# Altium schematic sheet nixie_peripherals.SchDoc: Nixie Peripherals
size A4; Author: Manuel Diaz Alonso; Address1: 2; Address2: 2; Revision: 1; SheetNumber: 2; SheetTotal: 2
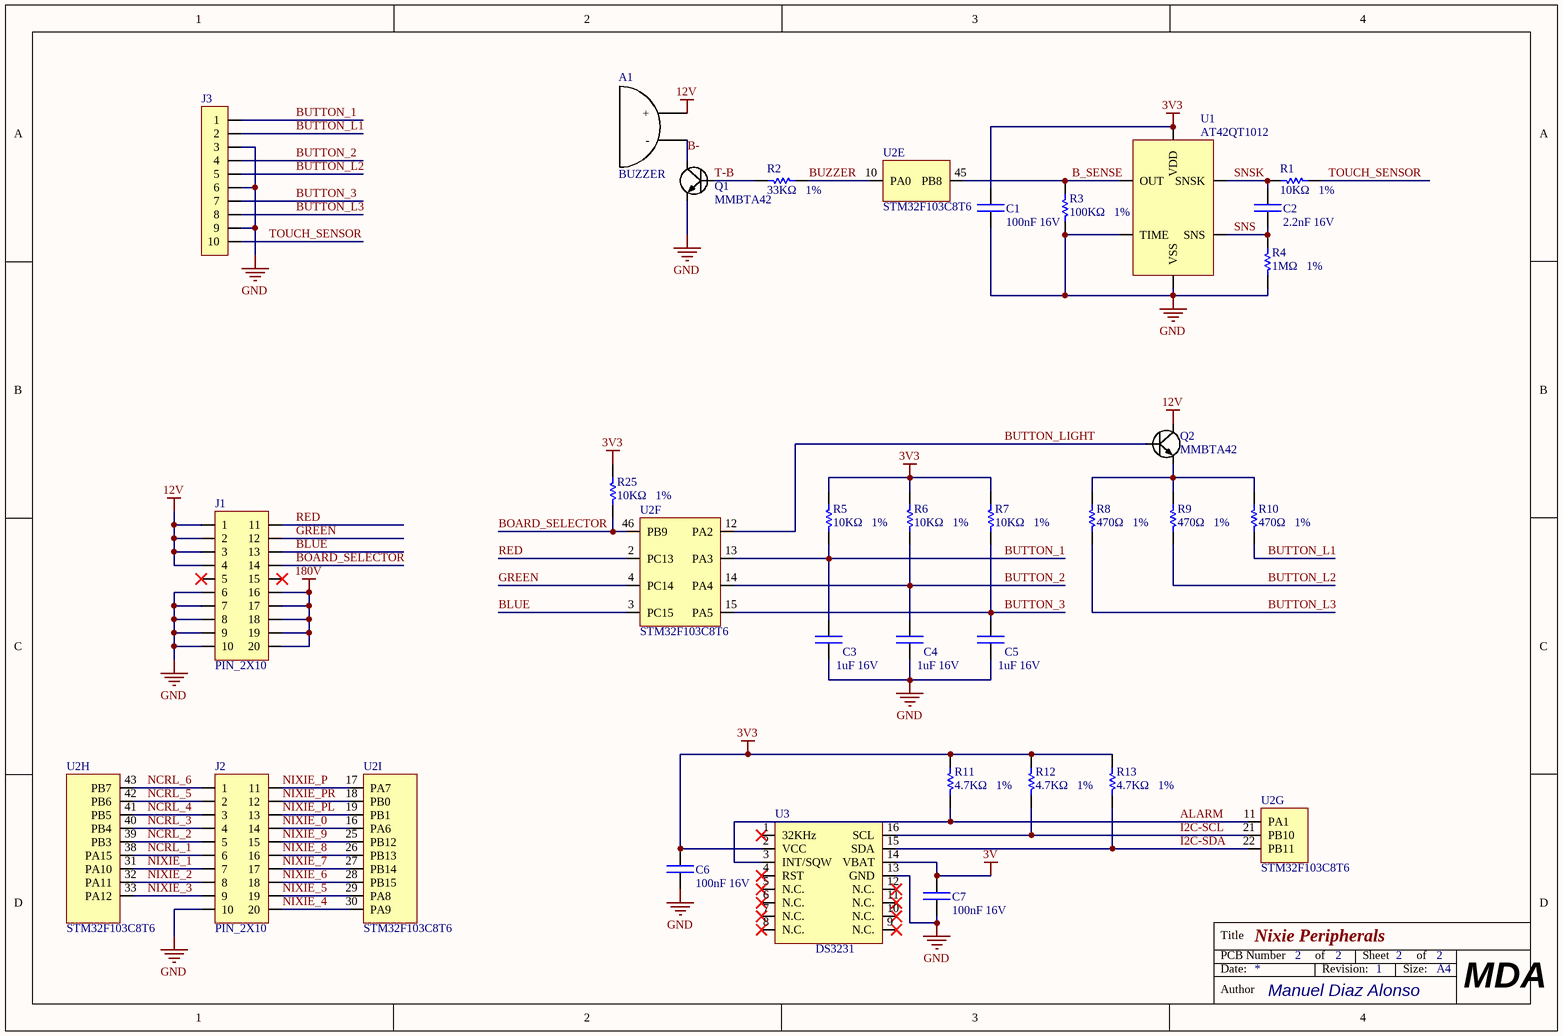
[diagram p0: nixie_peripherals.SchDoc]

## Parts
A1  BUZZER  [BUZZER]
C1  100nF 16V  [0603]
C2  2.2nF 16V  [0603]
C3  1uF 16V  [0603]
C4  1uF 16V  [0603]
C5  1uF 16V  [0603]
C6  100nF 16V  [0603]
C7  100nF 16V  [0603]
J1  PIN_2X10  [PIN_2X10_SKT]
J2  PIN_2X10  [PIN_2X10_SKT]
J3  HEADERx10  [HEADERx10]  (value not drawn)
Q1  MMBTA42  [SOT-23]
Q2  MMBTA42  [SOT-23]
R1  10KΩ   1%  [0603]
R2  33KΩ   1%  [0603]
R3  100KΩ   1%  [0603]
R4  1MΩ   1%  [0603]
R5  10KΩ   1%  [0603]
R6  10KΩ   1%  [0603]
R7  10KΩ   1%  [0603]
R8  470Ω   1%  [0603]
R9  470Ω   1%  [0603]
R10  470Ω   1%  [0603]
R11  4.7KΩ   1%  [0603]
R12  4.7KΩ   1%  [0603]
R13  4.7KΩ   1%  [0603]
R25  10KΩ   1%  [0603]
U1  AT42QT1012  [SOT-23-6]
U2  STM32F103C8T6  [LQFP48]  (parts E,F,G,H,I of 9)
U3  DS3231  [SO16W]

## Nets
3V: C7.2 U3.14(VBAT)
3V3: C1.1 C6.2 R5.2 R6.2 R7.2 R11.2 R12.2 R13.2 R25.1 U1.5(VDD) U3.2(VCC)
12V: A1.1(+) J1.1 J1.2 J1.3 J1.4 Q2.3(C)
180V: J1.16 J1.17 J1.18 J1.19 J1.20
GND: C1.2 C3.1 C4.1 C5.1 C6.1 C7.1 J1.6 J1.7 J1.8 J1.9 J1.10 J2.10 J3.3 J3.6 J3.9 Q1.2(E) R3.1 R4.2 U1.2(VSS) U1.6(TIME) U3.13(GND)
ALARM: R11.1 U2.11(PA1) U3.3(INT/SQW)
B-: A1.2(-) Q1.3(C)
B_SENSE: R3.2 U1.1(OUT) U2.45(PB8)
BLUE: J1.13 U2.3(PC15)
BOARD_SELECTOR: J1.14 R25.2 U2.46(PB9)
BUTTON_1: C3.2 J3.1 R5.1 U2.13(PA3)
BUTTON_2: C4.2 J3.4 R6.1 U2.14(PA4)
BUTTON_3: C5.2 J3.7 R7.1 U2.15(PA5)
BUTTON_L1: J3.2 R10.2
BUTTON_L2: J3.5 R9.2
BUTTON_L3: J3.8 R8.2
BUTTON_LIGHT: Q2.1(B) U2.12(PA2)
BUZZER: R2.2 U2.10(PA0)
GREEN: J1.12 U2.4(PC14)
I2C-SCL: R12.1 U2.21(PB10) U3.16(SCL)
I2C-SDA: R13.1 U2.22(PB11) U3.15(SDA)
NCRL_1: J2.6 U2.38(PA15)
NCRL_2: J2.5 U2.39(PB3)
NCRL_3: J2.4 U2.40(PB4)
NCRL_4: J2.3 U2.41(PB5)
NCRL_5: J2.2 U2.42(PB6)
NCRL_6: J2.1 U2.43(PB7)
NIXIE_0: J2.14 U2.16(PA6)
NIXIE_1: J2.7 U2.31(PA10)
NIXIE_2: J2.8 U2.32(PA11)
NIXIE_3: J2.9 U2.33(PA12)
NIXIE_4: J2.20 U2.30(PA9)
NIXIE_5: J2.19 U2.29(PA8)
NIXIE_6: J2.18 U2.28(PB15)
NIXIE_7: J2.17 U2.27(PB14)
NIXIE_8: J2.16 U2.26(PB13)
NIXIE_9: J2.15 U2.25(PB12)
NIXIE_P: J2.11 U2.17(PA7)
NIXIE_PL: J2.13 U2.19(PB1)
NIXIE_PR: J2.12 U2.18(PB0)
RED: J1.11 U2.2(PC13)
SNS: C2.2 R4.1 U1.4(SNS)
SNSK: C2.1 R1.2 U1.3(SNSK)
T-B: Q1.1(B) R2.1
TOUCH_SENSOR: J3.10 R1.1
NetQ2_2: Q2.2(E) R8.1 R9.1 R10.1

Not connected (* = marked no-connect by the designer): J1 5* 15*; U3 1(32KHz)* 4(RST)* 5(N.C.)* 6(N.C.)* 7(N.C.)* 8(N.C.)* 9(N.C.)* 10(N.C.)* 11(N.C.)* 12(N.C.)*

## Notes on the sheet
- Title
- PCB Number
- Date:
- of
- Revision:
- Sheet
- Size:
- A4
- Author
- MDA

## Library data of the parts
C1-C7 = CAP
J1 J2 = PIN_2X10: SSW-110-01-L-D; System: Connector
J3 = HEADERx10: 1-282837-0
Q1 Q2 = NPN
R1-R13 R25 = RES